# Altium schematic sheet Power_Stage.SchDoc
size B
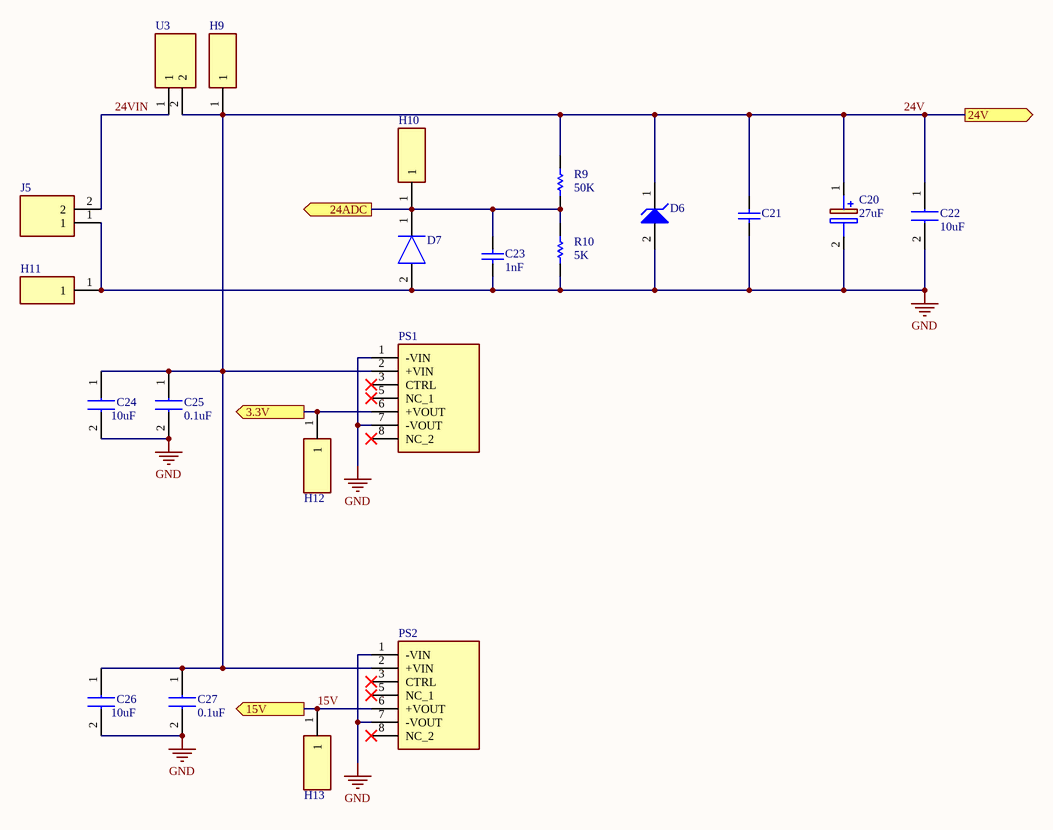
[diagram p0: Power_Stage.SchDoc]

## Parts
C20  27uF  [CAPPRD200W55D500H1250]
C21  VC060326A580RP  [CAPC1608X90X35ML15T15]  (value not drawn)
C22  10uF  [MKS4B051004J00KSSD]
C23  1nF  [CAPC2013X95X45NL10T25]
C24  value 10uF  [MKS4B051004J00KSSD]  (hidden comment: MKS4B051004J00KSSD)
C25  value 0.1uF  [K104K10X7RF5UH5]  (hidden comment: K104K10X7RF5UH5)
C26  value 10uF  [MKS4B051004J00KSSD]  (hidden comment: MKS4B051004J00KSSD)
C27  value 0.1uF  [K104K10X7RF5UH5]  (hidden comment: K104K10X7RF5UH5)
D6  P6KE47A  [ONSC-SURMETIC40-2-017AA-01]  (value not drawn)
D7  BZX584C3V3-G3-08  [SODFL1608X75N]  (value not drawn)
H9  5003  [5003]  (value not drawn)
H10  5003  [5003]  (value not drawn)
H11  5003  [5003]  (value not drawn)
H12  5003  [5003]  (value not drawn)
H13  5003  [5003]  (value not drawn)
J5  1985881  [SHDR2W110P0X500_1X2_1000X985X1390P]  (value not drawn)
PS1  RS3-243.3S  [RS32433S]  (value not drawn)
PS2  RS3-2415S  [RS32415S]  (value not drawn)
R9  value 50K  [AXIAL-0.3]  (hidden comment: Res1)
R10  value 5K  [AXIAL-0.3]  (hidden comment: Res1)
U3  0PTF0078P  [0PTF0078P]  (value not drawn)

## Ports
3.3V (out), 15V (out), 24ADC (out), 24V (out)

## Nets
GND: C20.2(-) C21.1 C22.2 C23.1 C24.2 C25.2 C26.2 C27.2 D6.2(A) D7.2(A) H11.1 J5.1 PS1.1(-VIN) PS1.7(-VOUT) PS2.1(-VIN) PS2.7(-VOUT) R10.1
3.3V: H12.1 PS1.6(+VOUT) ; port 3.3V
15V: H13.1 PS2.6(+VOUT) ; port 15V
24ADC: C23.2 D7.1(K) H10.1 R9.1 R10.2 ; port 24ADC
24V: C20.1(+) C21.2 C22.1 C24.1 C25.1 C26.1 C27.1 D6.1(K) H9.1 PS1.2(+VIN) PS2.2(+VIN) R9.2 U3.2 ; port 24V
24VIN: J5.2 U3.1

Not connected (* = marked no-connect by the designer): PS1 3(CTRL)* 5(NC_1)* 8(NC_2)*; PS2 3(CTRL)* 5(NC_1)* 8(NC_2)*

## Library data of the parts
C20 = EEU-FS1H270B: 50V 27uF electrolytic cap EEU-FS1H270B; Manufacturer_Name: Panasonic; Datasheet Link: https://componentsearchengine.com/Datasheets/1/EEU-FS1H270B.pdf; Height: 12.5mm; Manufacturer_Part_Number: EEU-FS1H270B; Mouser Part Number: 667-EEU-FS1H270B; Mouser Price/Stock: https://www.mouser.com/Search/Refine.aspx?Keyword=667-EEU-FS1H270B
C21 = CMP-2006-02022-1: Manufacturer: AVX Interconnect / Elco; Part Number: VC060326A580RP
C22 = MKS4B051004J00KSSD: Manufacturer_Name: WIMA; Datasheet Link: https://www.mouser.com/datasheet/2/440/e_WIMA_MKS_4-1139797.pdf; Height: 16mm; Manufacturer_Part_Number: MKS4B051004J00KSSD; Mouser Part Number: 505-MKS410/50/10; Mouser Price/Stock: https://www.mouser.com/Search/Refine.aspx?Keyword=505-MKS410%2F50%2F10
C23 = CMP-2007-00148-1: Part Number: GRM2195C2A102JA01D; Manufacturer: Murata
C24 C26 = MKS4B051004J00KSSD: Capacitor 50V; Manufacturer_Name: WIMA; Datasheet Link: https://www.mouser.com/datasheet/2/440/e_WIMA_MKS_4-1139797.pdf; Height: 16mm; Manufacturer_Part_Number: MKS4B051004J00KSSD; Mouser Part Number: 505-MKS410/50/10; Mouser Price/Stock: https://www.mouser.com/Search/Refine.aspx?Keyword=505-MKS410%2F50%2F10
C25 C27 = K104K10X7RF5UH5: Capacitor 50V; Manufacturer_Name: Vishay; Datasheet Link: https://www.vishay.com/docs/45171/kseries.pdf; Height: 6.2mm; Manufacturer_Part_Number: K104K10X7RF5UH5; Mouser Part Number: 594-K104K10X7RF5UH5; Mouser Price/Stock: https://www.mouser.com/Search/Refine.aspx?Keyword=594-K104K10X7RF5UH5
D6 = CMP-1061-00684-1: 600 W Peak Power Transient Voltage Suppressor, 2-Pin Surmetic(TM) 40, Pb-Free, Bulk Box. [40V TVS Diode (P6KE47A)]; PartNumber: P6KE47AG; Manufacturer: On Semiconductor; Direction: Unidirectional; PPK Max (W): 600; V(BR) Typ (V): 47.05; IR Max (uA): 5; PackageVersion: Rev. O, 09/2005; PackageDescription: 2-Pin, Axial Lead, Diameter 3.49 mm; Mounting Technology: Through Hole; ComponentLink1URL: http://www.onsemi.com/; Packing: Bulk Box; ComponentLink2Description: Datasheet; RoHS: Pb-Free; DatasheetVersion: Rev. 10; ComponentLink1Description: Manufacturer URL; ComponentLink3URL: http://www.onsemi.cn/pub_link/Collateral/017AA.PDF; ComponentLink3Description: Package Specification; ComponentLink2URL: http://www.onsemi.com/pub_link/Collateral/P6KE6.8A-D.PDF; PackageReference: SURMETIC40-2-017AA-01
D7 = BZX584C3V3-G3-08: Diode; Manufacturer_Name: Vishay; Datasheet Link: https://componentsearchengine.com/Datasheets/1/BZX584C3V3-G3-08.pdf; Height: 0.75mm; Manufacturer_Part_Number: BZX584C3V3-G3-08; Mouser Part Number: 78-BZX584C3V3-G3-08; Mouser Price/Stock: https://www.mouser.com/Search/Refine.aspx?Keyword=78-BZX584C3V3-G3-08
H9-H13 = 5003: Hardware; Manufacturer_Name: Keystone Electronics; Allied_Number: 70799414; Datasheet Link: https://componentsearchengine.com/Datasheets/1/5003.pdf; Height: 4.57mm; Manufacturer_Part_Number: 5003; Mouser Part Number: 534-5003; Mouser Price/Stock: https://www.mouser.com/Search/Refine.aspx?Keyword=534-5003; Allied Price/Stock: https://www.alliedelec.com/keystoneelectronics-5003/70799414/
J5 = 1985881: 2-Port Connector; Manufacturer_Name: Phoenix Contact; Allied_Number: 70353630; Datasheet Link: https://www.phoenixcontact.com/online/portal/us?uri=pxc-oc-itemdetail:pid=1985881&library=usen&tab=1; Height: 13.9mm; Manufacturer_Part_Number: 1985881; Mouser Part Number: 651-1985881; Mouser Price/Stock: https://www.mouser.com/Search/Refine.aspx?Keyword=651-1985881; RS Part Number: 4670338; RS Price/Stock: http://uk.rs-online.com/web/p/products/4670338; Allied Price/Stock: https://www.alliedelec.com/phoenixcontact-1985881/70353630/
PS1 = RS3-243.3S: Power Supply; Manufacturer_Name: RECOM Power; Datasheet Link: https://www.arrow.com/en/products/rs3-243.3s/recom-power; Height: 11.35mm; Manufacturer_Part_Number: RS3-243.3S; Mouser Part Number: 919-RS3-243.3S; Mouser Price/Stock: https://www.mouser.com/Search/Refine.aspx?Keyword=919-RS3-243.3S; RS Part Number: 0163748P; RS Price/Stock: http://uk.rs-online.com/web/p/products/0163748P
PS2 = RS3-2415S: Power Supply; Manufacturer_Name: RECOM Power; Datasheet Link: https://www.recom-power.com/pdf/Econoline/RS3-S_D_Z.pdf; Height: 11.35mm; Manufacturer_Part_Number: RS3-2415S; Mouser Part Number: 919-RS3-2415S; Mouser Price/Stock: https://www.mouser.com/Search/Refine.aspx?Keyword=919-RS3-2415S
R9 R10 = Res1: Resistor; Published: 8-Jun-2000; LatestRevisionDate: 17-Jul-2002; LatestRevisionNote: Re-released for DXP Platform.; PackageReference: AXIAL-0.3; Publisher: Altium Limited; PackageDescription: Axial Device, Thru-Hole; 2 Leads; 0.3 in Pin Spacing
U3 = 0PTF0078P: Fuse holder; Manufacturer_Name: LITTELFUSE; Datasheet Link: https://media.digikey.com/pdf/Data%20Sheets/Littelfuse%20PDFs/PTF075_77_78.pdf; Height: 11.5mm; Manufacturer_Part_Number: 0PTF0078P; Mouser Part Number: 576-0PTF0078P; Mouser Price/Stock: https://www.mouser.com/Search/Refine.aspx?Keyword=576-0PTF0078P; RS Part Number: 1740656; RS Price/Stock: http://uk.rs-online.com/web/p/products/1740656